# EAGLE design chessclock (EAGLE 9.6.0)
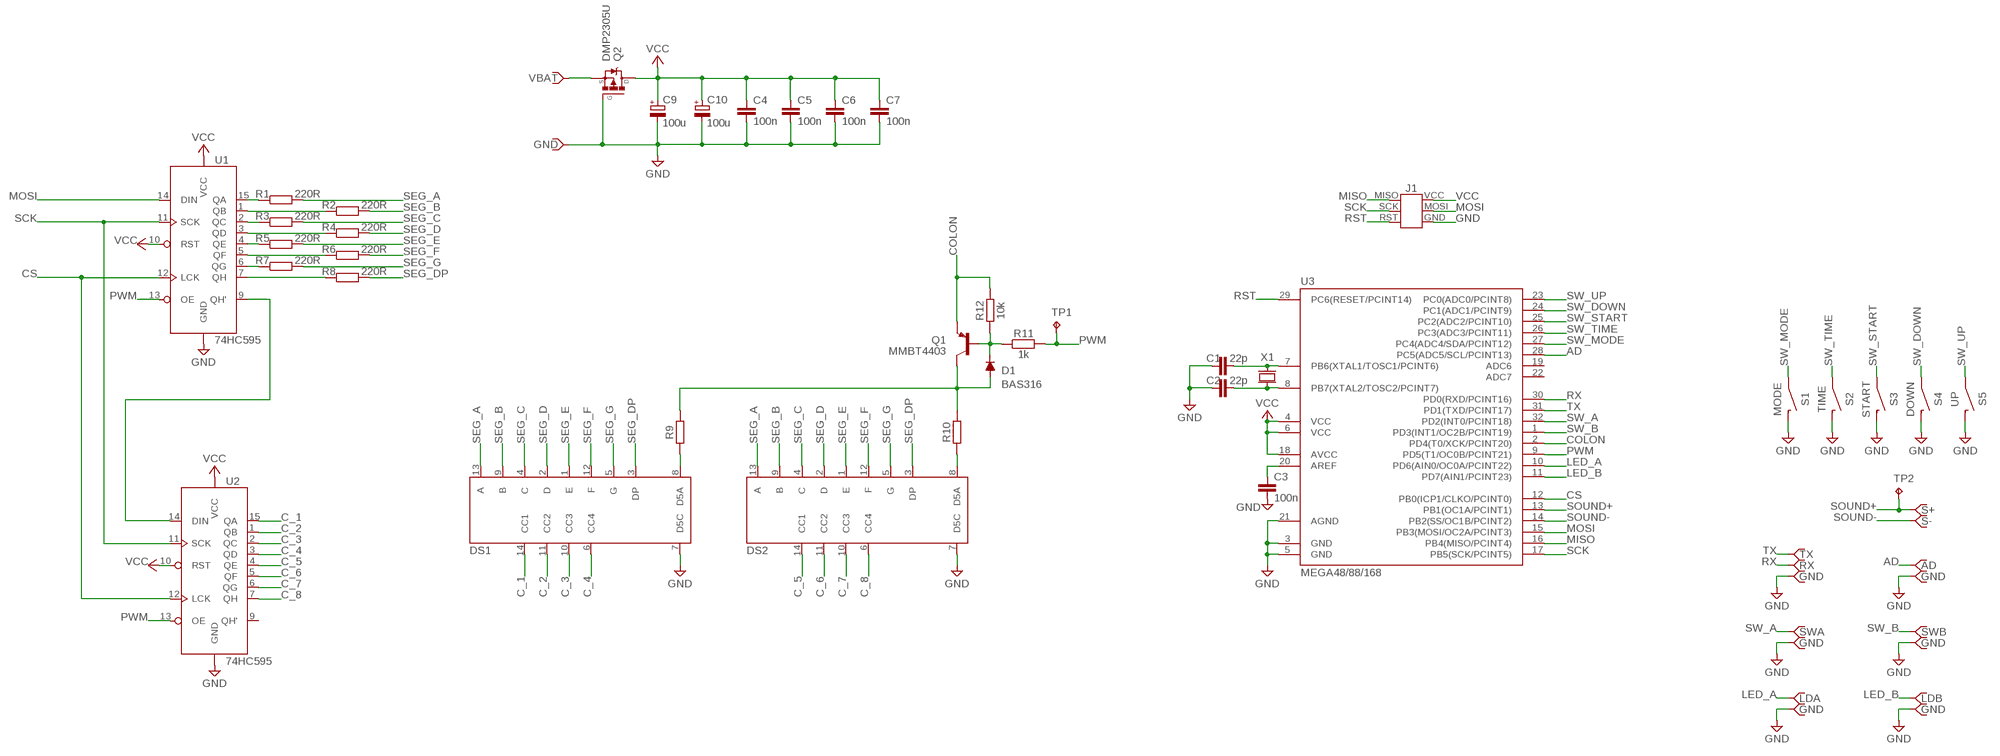
[diagram p0: schematic, sheet 1]

## Parts
C1  22p  CAPACITOR0603  [C_0603]
C2  22p  CAPACITOR0603  [C_0603]
C3  100n  CAPACITOR0603  [C_0603]
C4  100n  CAPACITOR0603  [C_0603]
C5  100n  CAPACITOR0603  [C_0603]
C6  100n  CAPACITOR0603  [C_0603]
C7  100n  CAPACITOR0603  [C_0603]
C9  100u  CAPACITOR_POLARISEDTH_FLAT_L_5MM  [C_E_TH_FLAT_L_5MM]
C10  100u  CAPACITOR_POLARISEDTH_FLAT_L_5MM  [C_E_TH_FLAT_L_5MM]
D1  BAS316  [SOD323]
DS1  SLR0564FR1C4BD-3.5  [SLR0564FR1C4BD-3.5]
DS2  SLR0564FR1C4BD-3.5  [SLR0564FR1C4BD-3.5]
J1  AVRISPVERT  [AVRISP]
P1  SWA  CON_PIN_2MM  [CON_PIN_2MM]
P2  GND  CON_PIN_2MM  [CON_PIN_2MM]
P3  LDA  CON_PIN_2MM  [CON_PIN_2MM]
P4  GND  CON_PIN_2MM  [CON_PIN_2MM]
P5  SWB  CON_PIN_2MM  [CON_PIN_2MM]
P6  GND  CON_PIN_2MM  [CON_PIN_2MM]
P7  LDB  CON_PIN_2MM  [CON_PIN_2MM]
P8  GND  CON_PIN_2MM  [CON_PIN_2MM]
P9  GND  CON_PIN_2MM  [CON_PIN_2MM]
P10  VBAT  CON_PIN_2MM  [CON_PIN_2MM]
P11  S+  CON_PIN_2MM  [CON_PIN_2MM]
P12  S-  CON_PIN_2MM  [CON_PIN_2MM]
P13  GND  CON_PIN  [CON_PIN]
P14  RX  CON_PIN  [CON_PIN]
P15  TX  CON_PIN  [CON_PIN]
P16  GND  CON_PIN  [CON_PIN]
P17  AD  CON_PIN  [CON_PIN]
Q1  MMBT4403  MMBT4403LT1  [SOT23]
Q2  DMP2305U  [SOT23]
R1  220R  RESISTOR0603  [R_0603]
R2  220R  RESISTOR0603  [R_0603]
R3  220R  RESISTOR0603  [R_0603]
R4  220R  RESISTOR0603  [R_0603]
R5  220R  RESISTOR0603  [R_0603]
R6  220R  RESISTOR0603  [R_0603]
R7  220R  RESISTOR0603  [R_0603]
R8  220R  RESISTOR0603  [R_0603]
R9  RESISTOR0603  [R_0603]
R10  RESISTOR0603  [R_0603]
R11  1k  RESISTOR0603  [R_0603]
R12  10k  RESISTOR0603  [R_0603]
S1  MODE  SPST_6X6MM  [SPST_6X6MM]
S2  TIME  SPST_6X6MM  [SPST_6X6MM]
S3  START  SPST_6X6MM  [SPST_6X6MM]
S4  DOWN  SPST_6X6MM  [SPST_6X6MM]
S5  UP  SPST_6X6MM  [SPST_6X6MM]
TP1  TPTP15R  [TP15R]
TP2  TPTP15R  [TP15R]
U1  74HC595  [SOIC16]
U2  74HC595  [SOIC16]
U3  MEGA48/88/168  [TQFP32-08]
X1  XTAL_32768HZ2X6  [XTAL_2X6MM]

## Nets
AD: P17.1 U3.28(PC5(ADC5/SCL/PCINT13))
C_1: DS1.14(CC1) U2.15(QA)
C_2: DS1.11(CC2) U2.1(QB)
C_3: DS1.10(CC3) U2.2(QC)
C_4: DS1.6(CC4) U2.3(QD)
C_5: DS2.14(CC1) U2.4(QE)
C_6: DS2.11(CC2) U2.5(QF)
C_7: DS2.10(CC3) U2.6(QG)
C_8: DS2.6(CC4) U2.7(QH)
COLON: Q1.2(E) R12.2 U3.2(PD4(T0/XCK/PCINT20))
CS: U1.12(LCK) U2.12(LCK) U3.12(PB0(ICP1/CLKO/PCINT0))
GND: C1.2 C2.2 C3.1 C4.1 C5.1 C6.1 C7.1 C9.- C10.- DS1.7(D5C) DS2.7(D5C) J1.GND P2.1 P4.1 P6.1 P8.1 P9.1 P13.1 P16.1 Q2.1(G) S1.3 S1.4 S2.3 S2.4 S3.3 S3.4 S4.3 S4.4 S5.3 S5.4 U1.8(GND) U2.8(GND) U3.3(GND) U3.5(GND) U3.21(AGND)
LED_A: P3.1 U3.10(PD6(AIN0/OC0A/PCINT22))
LED_B: P7.1 U3.11(PD7(AIN1/PCINT23))
MISO: J1.MISO U3.16(PB4(MISO/PCINT4))
MOSI: J1.MOSI U1.14(DIN) U3.15(PB3(MOSI/OC2A/PCINT3))
N$1: C1.1 U3.7(PB6(XTAL1/TOSC1/PCINT6)) X1.1
N$2: C2.1 U3.8(PB7(XTAL2/TOSC2/PCINT7)) X1.2
N$3: R2.1 U1.1(QB)
N$4: R1.1 U1.15(QA)
N$5: R3.1 U1.2(QC)
N$6: D1.A Q1.3(C) R9.2 R10.2
N$7: D1.C Q1.1(B) R11.1 R12.1
N$8: C3.2 U3.20(AREF)
N$12: R5.1 U1.4(QE)
N$13: R4.1 U1.3(QD)
N$14: R6.1 U1.5(QF)
N$15: R7.1 U1.6(QG)
N$17: R8.1 U1.7(QH)
N$19: U1.9(QH') U2.14(DIN)
N$20: DS2.8(D5A) R10.1
N$28: DS1.8(D5A) R9.1
PWM: R11.2 TP1.TP U1.13(OE) U2.13(OE) U3.9(PD5(T1/OC0B/PCINT21))
RST: J1.RST U3.29(PC6(RESET/PCINT14))
RX: P14.1 U3.30(PD0(RXD/PCINT16))
SCK: J1.SCK U1.11(SCK) U2.11(SCK) U3.17(PB5(SCK/PCINT5))
SEG_A: DS1.13(A) DS2.13(A) R1.2
SEG_B: DS1.9(B) DS2.9(B) R2.2
SEG_C: DS1.4(C) DS2.4(C) R3.2
SEG_D: DS1.2(D) DS2.2(D) R4.2
SEG_DP: DS1.3(DP) DS2.3(DP) R8.2
SEG_E: DS1.1(E) DS2.1(E) R5.2
SEG_F: DS1.12(F) DS2.12(F) R6.2
SEG_G: DS1.5(G) DS2.5(G) R7.2
SOUND+: P11.1 TP2.TP U3.13(PB1(OC1A/PCINT1))
SOUND-: P12.1 U3.14(PB2(SS/OC1B/PCINT2))
SW_A: P1.1 U3.32(PD2(INT0/PCINT18))
SW_B: P5.1 U3.1(PD3(INT1/OC2B/PCINT19))
SW_DOWN: S4.1 S4.2 U3.24(PC1(ADC1/PCINT9))
SW_MODE: S1.1 S1.2 U3.27(PC4(ADC4/SDA/PCINT12))
SW_START: S3.1 S3.2 U3.25(PC2(ADC2/PCINT10))
SW_TIME: S2.1 S2.2 U3.26(PC3(ADC3/PCINT11))
SW_UP: S5.1 S5.2 U3.23(PC0(ADC0/PCINT8))
TX: P15.1 U3.31(PD1(TXD/PCINT17))
VBAT: P10.1 Q2.2(S)
VCC: C4.2 C5.2 C6.2 C7.2 C9.+ C10.+ J1.VCC Q2.3(D) U1.10(RST) U1.16(VCC) U2.10(RST) U2.16(VCC) U3.4(VCC) U3.6(VCC) U3.18(AVCC)
Unconnected: U2.9(QH') U3.19(ADC6) U3.22(ADC7)

## Library data of the parts
C1-C7 = a_passive:CAPACITOR
C9 C10 = a_passive:CAPACITOR_POLARISED: Polarised electrolytic capacitors Nichicon WT series
D1 = a_diode:BAS316
DS1 DS2 = a_diode:SLR0564FR1C4BD-3.5
J1 = a_misc:AVRISP: AVR ISP-6 Serial Programming Header
P1-P17 = a_misc:CON_PIN
Q1 = a_transistor:MMBT4403: PNP Transistor
Q2 = a_transistor:DMP2305U
R1-R12 = a_passive:RESISTOR
S1-S5 = a_misc:SPST_6X6MM
TP1 TP2 = a_misc:TP: Test pad
U1 U2 = a_ic:74HC595
U3 = a_ic:MEGA48/88/168
X1 = a_misc:XTAL_32768HZ

## Board
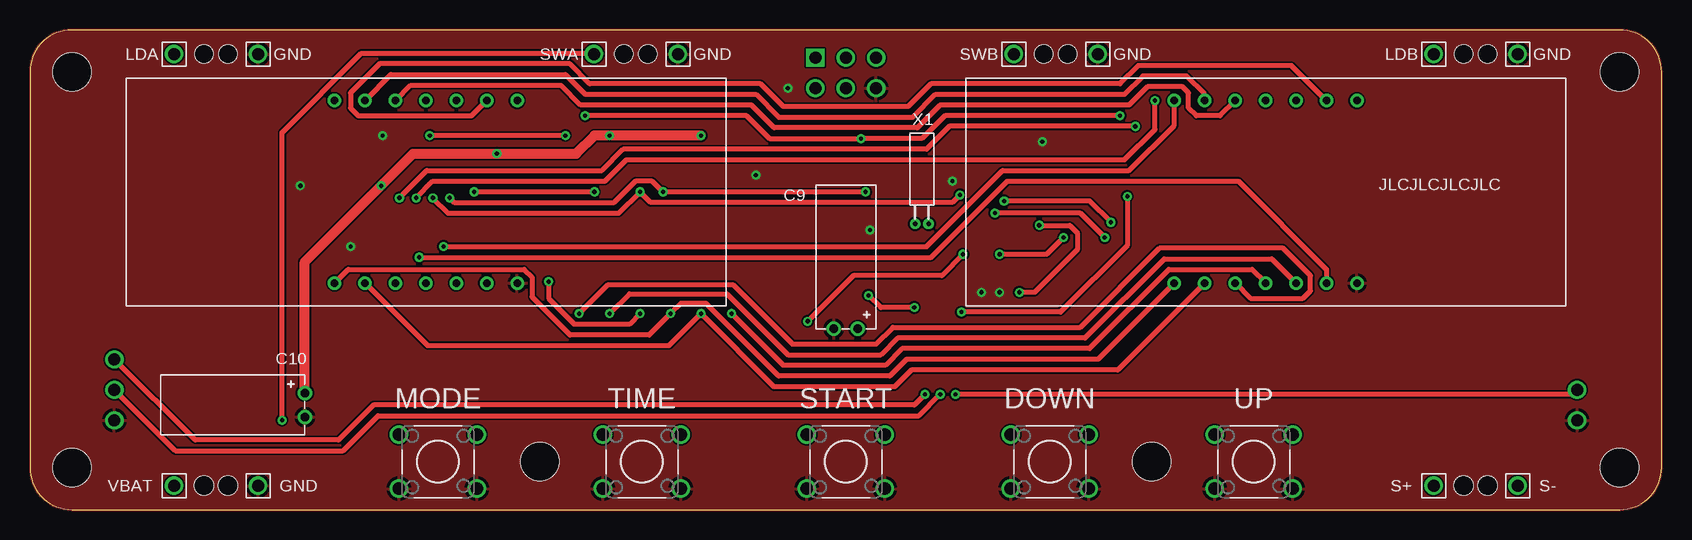
[diagram p1: board, top side]
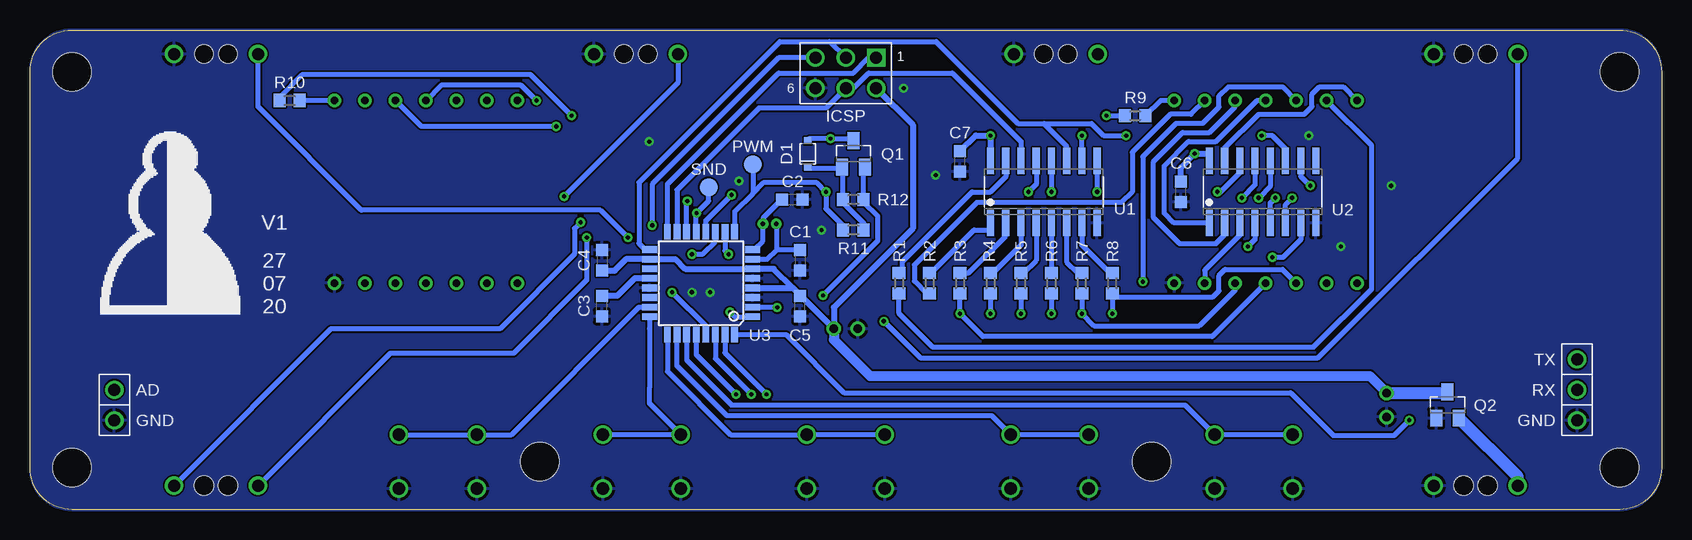
[diagram p2: board, bottom side, seen from below]

Size 136 x 40 mm. Coordinates in mm from the lower left corner, seen from the top.
Outline: 0,36.5 0,3.5 arc90 3.5,0 132.5,0 arc90 136,3.5 136,36.5 arc90 132.5,40 3.5,40 arc90 0,36.5
Copper layers (1*16): Top 0.035mm / dielectric 1.5mm / Bottom 0.035mm
Design rules "default *": minimum track width 6mil, minimum drill 0.35mm, track to track 6mil, track to pad 6mil, pad to pad 6mil, via to via 6mil, smd to smd 6mil, copper to edge 0mil, drill to drill 6mil, minimum pad ring 10mil, minimum via ring 8mil, stop-mask expansion 4mil, vias tented up to drill 0mil, thermal gap 10mil
Holes 3.2 mm at 132.5,36.5 3.5,36.5 3.5,3.5 132.5,3.5 93.5,4 42.5,4
Holes 1.5 mm at 86.5,38 84.5,38 121.5,38 119.5,38 16.5,38 14.5,38 51.5,38 49.5,38
Holes 1.6 mm at 16.5,2 14.5,2 121.5,2 119.5,2

### Footprints (pad centres in the part's own frame; a part is rotated, then mirrored left to right if it is on the bottom)
C_0603 = smd 1 x 1: 1 -0.85,0; 2 0.85,0
C_E_TH_FLAT_L_5MM = drill 0.7: + -1,0; - 1,0
SOD323 = smd 0.6 x 0.6: A 1.1,0; C -1.1,0
SLR0564FR1C4BD-3.5 = drill 0.6: 1 -7.62,-7.62; 2 -5.08,-7.62; 3 -2.54,-7.62; 4 0,-7.62; 5 2.54,-7.62; 6 5.08,-7.62; 7 7.62,-7.62; 8 7.62,7.62; 9 5.08,7.62; 10 2.54,7.62; 11 0,7.62; 12 -2.54,7.62; 13 -5.08,7.62; 14 -7.62,7.62
AVRISP = drill 1: GND 2.54,1.27; MOSI 0,1.27; RST 2.54,-1.27; SCK 0,-1.27; VCC -2.54,1.27 | drill 1 square: MISO -2.54,-1.27
CON_PIN_2MM = drill 1: 1 0,0
CON_PIN = drill 1: 1 0,0
SOT23 = smd 1 x 1.4: 1 -0.95,-1.1; 2 0.95,-1.1; 3 0,1.1
R_0603 = smd 1 x 1.1: 1 -0.85,0; 2 0.85,0
SPST_6X6MM = drill 1.016: 1 -3.25,2.25; 2 3.25,2.25; 3 -3.25,-2.25; 4 3.25,-2.25
TP15R = smd 1.5 x 1.5: TP 0,0
SOIC16 = smd 0.6 x 2.2: 1 -4.445,-2.6; 2 -3.175,-2.6; 3 -1.905,-2.6; 4 -0.635,-2.6; 5 0.635,-2.6; 6 1.905,-2.6; 7 3.175,-2.6; 8 4.445,-2.6; 9 4.445,2.6; 10 3.175,2.6; 11 1.905,2.6; 12 0.635,2.6; 13 -0.635,2.6; 14 -1.905,2.6; 15 -3.175,2.6; 16 -4.445,2.6
TQFP32-08 = smd 1.27 x 0.559: 1 -4.293,2.8; 2 -4.293,2; 3 -4.293,1.2; 4 -4.293,0.4; 5 -4.293,-0.4; 6 -4.293,-1.2; 7 -4.293,-2; 8 -4.293,-2.8; 17 4.293,-2.8; 18 4.293,-2; 19 4.293,-1.2; 20 4.293,-0.4; 21 4.293,0.4; 22 4.293,1.2; 23 4.293,2; 24 4.293,2.8 | smd 0.559 x 1.27: 9 -2.8,-4.293; 10 -2,-4.293; 11 -1.2,-4.293; 12 -0.4,-4.293; 13 0.4,-4.293; 14 1.2,-4.293; 15 2,-4.293; 16 2.8,-4.293; 25 2.8,4.293; 26 2,4.293; 27 1.2,4.293; 28 0.4,4.293; 29 -0.4,4.293; 30 -1.2,4.293; 31 -2,4.293; 32 -2.8,4.293
XTAL_2X6MM = drill 0.4 pad 0.635: 1 -0.559,-4.572; 2 0.559,-4.572

### Placement (x,y rotation side)
C1  71.81,20.79 270 bottom
C2  72.44,25.86 0 bottom
C3  88.32,16.98 90 bottom
C4  88.32,20.79 270 bottom
C5  71.81,16.98 90 bottom
C6  40.06,26.5 90 bottom
C7  58.48,29.04 90 bottom
C9  68,15.07 180 top
C10  22.91,8.72 270 top
D1  71.17,29.68 90 bottom
DS1  33,26.5 0 top
DS2  103,26.5 0 top
J1  68,36.41 180 bottom
P1  47,38 90 top
P2  54,38 90 top
P3  12,38 90 top
P4  19,38 90 top
P5  82,38 90 top
P6  89,38 90 top
P7  117,38 90 top
P8  124,38 90 top
P9  19,2 0 top
P10  12,2 180 top
P11  117,2 180 top
P12  124,2 0 top
P13  7.04,7.45 0 bottom
P14  7.04,9.99 0 bottom
P15  7.04,12.53 0 bottom
P16  128.96,7.45 0 bottom
P17  128.96,9.99 0 bottom
Q1  67.36,29.68 0 bottom
Q2  17.84,8.72 0 bottom
R1  63.55,18.88 270 bottom
R2  61.02,18.88 270 bottom
R3  58.48,18.88 270 bottom
R4  55.94,18.88 270 bottom
R5  53.39,18.88 270 bottom
R6  50.86,18.88 270 bottom
R7  48.31,18.88 270 bottom
R8  45.77,18.88 270 bottom
R9  43.87,32.85 180 bottom
R10  114.35,34.12 180 bottom
R11  67.36,23.32 180 bottom
R12  67.36,25.86 0 bottom
S1  34,4 0 top
S2  51,4 0 top
S3  68,4 0 top
S4  85,4 0 top
S5  102,4 0 top
TP1  75.75,28.79 0 bottom
TP2  79.43,26.88 0 bottom
U1  51.49,26.5 0 bottom
U2  33.25,26.5 0 bottom
U3  80.06,18.88 180 bottom
X1  74.35,28.41 0 top

### Tracks (layer width: path | path; a pad name or v marks a point on that pad's centre or on a via)
AD  (via drill 0.35)
  Top 0.406: P17.1 128.58,9.61 v77.14,9.61
  Bottom 0.406: U3.28 80.47,12.93 v77.14,9.61
C_1
  Bottom 0.406: U2.15 36.42,30.13 33.58,32.98 29.77,32.98 29.14,33.61 29.14,34.63 28.5,35.26 26.52,35.26 DS1.14
C_2
  Bottom 0.406: U2.1 40.64,23.9 41.46,24.72 41.46,28.66 39.42,30.69 37.14,30.69 33.71,34.12 DS1.11
C_3
  Bottom 0.406: DS1.10 35.54,33.61 37.7,31.45 39.93,31.45 42.35,29.04 42.35,24.34 40.19,22.18 37.14,22.18 36.42,22.9 U2.2
C_4
  Bottom 0.406: U2.3 35.16,22.9 38.08,19.97 DS1.6
C_5  (via drill 0.35)
  Top 0.406: v34.47,21.93 74.73,21.93 81.08,28.28 91.62,28.28 95.38,32.04 DS2.14
  Bottom 0.406: U2.4 33.88,22.52 v34.47,21.93
C_6  (via drill 0.35)
  Top 0.406: v32.19,25.99 33.58,27.39 47.93,27.39 49.71,29.17 91.24,29.17 93.78,31.71 v93.78,34.12
  Bottom 0.406: U2.5 32.62,25.56 v32.19,25.99 | v93.78,34.12 95.05,35.39 101.73,35.39 DS2.11
C_7  (via drill 0.35)
  Top 0.406: v30.79,25.99 33.08,28.28 47.68,28.28 49.46,30.06 74.73,30.06 76.64,31.96 v92.13,31.96
  Bottom 0.406: DS2.10 103.38,31.96 v92.13,31.96 | U2.6 31.34,25.44 v30.79,25.99
C_8  (via drill 0.35)
  Top 0.406: v32.44,21.04 75.11,21.04 81.46,27.39 100.71,27.39 108.08,20.02 DS2.6
  Bottom 0.406: U2.7 30.08,22.52 31.55,21.04 v32.44,21.04
COLON  (via drill 0.35)
  Top 0.406: v73.72,16.85 70.92,16.85 v69.91,17.86
  Bottom 0.406: U3.2 73.75,16.88 v73.72,16.85 | v69.91,17.86 65.33,22.44 65.33,24.47 66.52,25.65 R12.2 66.52,28.48 Q1.2
CS  (via drill 0.35)
  Top 0.406: v77.53,26.25 76.89,25.61 51.74,25.61 v50.86,26.5 49.08,24.72 34.85,24.72 v33.58,25.99
  Bottom 0.406: v77.53,26.25 79.66,24.11 U3.12 | U2.12 32.62,26.96 v33.58,25.99 | U1.12 v50.86,26.5
GND  (via drill 0.35)
  other vias: 80.83,18.12 70.03,23.32 76.89,27.39 29.39,31.2 26.73,21.93 22.53,27.01 79.3,18.12 60.51,27.9 63.17,35.14 84.38,30.69
  pour Top: 136,3.5 136,36.5 arc90 132.5,40 3.5,40 arc90 0,36.5 0,3.5 arc90 3.5,0 132.5,0 arc90
  pour Bottom: 3.5,40 132.5,40 arc-90 136,36.5 136,3.5 arc-90 132.5,0 3.5,0 arc-90 0,3.5 0,36.5 arc-90
LED_A  (via drill 0.35)
  Top 0.406: v77.78,21.29 76,19.52 68.64,19.52 v64.83,15.71
  Bottom 0.406: U3.10 78.06,21.58 v77.78,21.29 | v64.83,15.71 61.78,12.66 28.63,12.66 12,29.29 P3.1
LED_B  (via drill 0.35)
  Top 0.406: v80.83,21.29 84.76,21.29 v86.16,22.69
  Bottom 0.406: U3.11 78.86,22.37 79.94,21.29 v80.83,21.29 | P7.1 117,33.59 108.39,24.98 88.45,24.98 v86.16,22.69
MISO
  Bottom 0.406: U3.16 82.86,27.13 81.46,28.53 73.59,36.41 67.36,36.41 66.09,37.68 J1.MISO
MOSI
  Bottom 0.406: U3.15 82.06,26.66 75.24,33.48 69.65,33.48 J1.MOSI 67.36,35.14 66.09,36.41 59.11,36.41 53.39,30.69 U1.14
N$1
  Bottom 0.406: U3.7 74.98,20.88 74.76,20.88 74.55,20.88 73.79,21.63 | X1.1 73.79,21.63 | C1.1 73.79,21.63
N$2
  Bottom 0.406: U3.8 75.64,21.68 74.91,22.42 X1.2 74.86,23.88 74.86,24.34 73.33,25.86 C2.1
N$3
  Bottom 0.406: R2.1 60.89,19.73 57.29,23.32 55.94,23.32 U1.1
N$4
  Bottom 0.406: U1.15 54.66,27.77 55.94,26.5 57.46,26.5 63.3,20.66 63.3,19.98 R1.1
N$5
  Bottom 0.406: U1.2 54.66,22.82 57.75,19.73 R3.1
N$6  (via drill 0.35)
  Top 0.406: v90.86,32.85 76.25,32.85 74.35,30.95 v69.27,30.95 61.65,30.95 59.74,32.85 v46.28,32.85
  Bottom 0.406: Q1.3 67.53,30.95 v69.27,30.95 71,30.95 D1.A | v46.28,32.85 R9.2 | R10.2 115.2,34.37 113.3,36.28 94.29,36.28 v90.86,32.85
N$7
  Bottom 0.406: 68.22,28.48 R12.1 68.22,25.61 66.52,23.91 R11.1 | 68.22,28.48 Q1.1 | D1.C 71.08,28.48 68.22,28.48
N$8
  Bottom 0.508: U3.20 85.59,19.28 87.05,17.82 C3.2
N$12
  Bottom 0.406: U1.4 52.12,20.79 53.18,19.73 R5.1
N$13
  Bottom 0.406: U1.3 53.39,22.05 55.72,19.73 R4.1
N$14
  Bottom 0.406: U1.5 R6.1
N$15
  Bottom 0.406: U1.6 49.59,20.66 48.66,19.73 R7.1
N$17
  Bottom 0.406: U1.7 48.31,22.05 45.99,19.73 R8.1
N$19  (via drill 0.35)
  Top 0.406: v47.05,26.5 v37.01,26.5
  Bottom 0.406: U2.14 35.16,28.1 36.76,26.5 v37.01,26.5 | U1.9 v47.05,26.5
N$20
  Bottom 0.406: DS2.8 R10.1
N$28
  Bottom 0.406: DS1.8 41.75,34.12 R9.1
PWM  (via drill 0.35)
  Top 0.406: v69.65,26.5 v52.76,26.5 51.87,27.39 50.47,27.39 48.7,25.61 35.36,25.61 v34.98,25.99
  Bottom 0.406: 75.75,26.37 77.27,24.86 U3.9 | 75.75,26.37 74.86,27.26 70.41,27.26 v69.65,26.5 69.65,25.1 68.22,23.67 R11.2 | U2.13 33.88,27.09 v34.98,25.99 | U1.13 52.12,27.14 v52.76,26.5 | TP1.TP 75.75,26.37
RST  (via drill 0.35)
  Top 0.406: v84.13,23.71 86.67,23.71 87.3,23.07 87.3,21.67 83.75,18.12 v82.48,18.12
  Bottom 0.406: J1.RST 73.59,37.68 84.13,27.14 v84.13,23.71 | U3.29 79.66,15.3 v82.48,18.12
RX  (via drill 0.35)
  Top 0.406: P14.1 12.12,4.91 26.09,4.91 29.01,7.83 74.1,7.83 v75.87,9.61
  Bottom 0.406: U3.30 78.86,12.6 v75.87,9.61
SCK  (via drill 0.35)
  Top 0.406: v44.63,31.2 v33.33,31.2
  Bottom 0.406: U3.17 84.74,21.68 85.25,22.19 85.25,27.29 73.5,39.03 69.36,39.03 | J1.SCK 69.36,39.03 | U2.11 31.34,30.1 32.44,31.2 v33.33,31.2 | U1.11 49.59,30.31 51.47,32.2 | 69.36,39.03 60.47,39.03 53.63,32.2 51.47,32.2 | 51.47,32.2 47.51,32.2 46.51,31.2 v44.63,31.2
SEG_A
  Top 0.406: DS2.13 97.92,34.63 96.4,36.15 92.77,36.15 91.24,34.63 75.49,34.63 73.59,32.72 62.41,32.72 60.51,34.63 46.28,34.63 44.63,36.28 30.08,36.28 DS1.13
  Bottom 0.406: R1.2 63.55,16.34 60.76,13.55 29.01,13.55 24.19,18.37 24.19,30.38 DS1.13
SEG_B
  Top 0.406: DS2.9 105.16,37.04 92.38,37.04 90.86,35.52 75.11,35.52 73.21,33.61 62.79,33.61 60.89,35.52 46.66,35.52 45.01,37.17 29.14,37.17 26.73,34.76 26.73,33.48 27.36,32.85 36.81,32.85 DS1.9
  Bottom 0.406: R2.2 61.27,18.03 62.28,19.05 62.28,20.4 57.08,25.61 45.01,25.61 44.12,26.5 44.12,29.8 40.95,32.98 39.22,32.98 DS1.9
SEG_C  (via drill 0.35)
  Top 0.406: v58.48,16.34 62.79,12.02 71.3,12.02 72.7,13.42 88.32,13.42 94.92,20.02 101.86,20.02 DS2.4
  Bottom 0.406: DS1.4 37.45,14.44 56.57,14.44 v58.48,16.34 R3.2
SEG_D  (via drill 0.35)
  Top 0.406: DS2.2 90.68,11.64 73.46,11.64 72.06,10.24 62.03,10.24 v55.94,16.34 53.27,13.67 33.13,13.67 DS1.2
  Bottom 0.406: R4.2 v55.94,16.34
SEG_DP  (via drill 0.35)
  Top 0.406: DS2.3 101.73,17.61 106.1,17.61 106.73,18.24 106.73,19.52 104.45,21.8 94.16,21.8 87.56,15.2 71.94,15.2 70.54,13.8 63.55,13.8 58.6,18.75 48.19,18.75 v45.77,16.34
  Bottom 0.406: DS1.3 31.6,20.02 36.38,20.02 36.89,19.52 36.89,18.24 37.39,17.74 45.48,17.74 R8.2 v45.77,16.34
SEG_E  (via drill 0.35)
  Top 0.406: DS1.1 26.52,20.02 41.2,20.02 41.84,19.39 41.84,17.74 45.01,14.56 51.62,14.56 v53.39,16.34 54.26,17.2 56.34,17.2 62.41,11.13 71.68,11.13 73.08,12.53 89.03,12.53 DS2.1
  Bottom 0.406: R5.2 v53.39,16.34
SEG_F  (via drill 0.35)
  Top 0.406: v50.86,16.34 49.97,15.45 45.39,15.45 43.23,17.61 v43.23,19.01 | DS1.12 31.73,35.39 44.25,35.39 45.9,33.74 60.13,33.74 62.03,31.83 73.97,31.83 75.87,33.74 91.62,33.74 93.15,35.26 96.07,35.26 96.58,34.76 96.58,33.48 97.21,32.85 99.19,32.85 DS2.12
  Bottom 0.406: R6.2 v50.86,16.34 | v43.23,19.01 43.23,29.42 40.44,32.22 38.23,32.22 36.89,33.56 36.89,34.5 36.12,35.26 31.6,35.26 DS1.12
SEG_G  (via drill 0.35)
  Top 0.406: v48.31,16.34 49.97,17.99 58.09,17.99 63.17,12.91 70.92,12.91 72.32,14.31 87.94,14.31 94.54,20.91 103.51,20.91 DS2.5
  Bottom 0.406: DS1.5 35.54,18.32 38.54,15.32 47.3,15.32 v48.31,16.34 R7.2
SOUND+  (via drill 0.35)
  Top 0.406: v89.59,22.69 87.56,24.72 v80.45,24.72
  Bottom 0.406: P11.1 105.96,13.04 95.69,13.04 89.59,19.13 v89.59,22.69 | U3.13 80.47,24.7 v80.45,24.72 79.43,25.74 TP2.TP
SOUND-  (via drill 0.35)
  Top 0.406: v90.1,23.96 88.32,25.74 v81.21,25.74
  Bottom 0.406: P12.1 110.93,15.07 96.83,15.07 90.61,21.29 90.61,23.45 v90.1,23.96 | U3.14 81.27,25.68 v81.21,25.74
SW_A  (via drill 0.35)
  Top 0.406: P1.1 46.94,38.06 27.61,38.06 21.01,31.45 v21.01,7.45
  Bottom 0.406: v21.01,7.45 22.28,6.18 27.36,6.18 30.92,9.74 68.13,9.74 72.98,14.59 U3.32
SW_B  (via drill 0.35)
  Top 0.406: v91.47,26.12 91.47,22.03 85.91,16.47 v77.65,16.47
  Bottom 0.406: P5.1 82,35.59 v91.47,26.12 | v77.65,16.47 77.27,16.08 U3.1
SW_DOWN
  Bottom 0.406: S4.2 S4.1 84.36,8.86 84.36,10.14 84.36,15.07 U3.24
SW_MODE
  Bottom 0.406: S1.1 S1.2 39.72,8.72 77.53,8.72 81.27,12.46 U3.27
SW_START
  Bottom 0.406: S3.1 S3.2 77.59,6.25 82.86,11.52 U3.25
SW_TIME
  Bottom 0.406: S2.1 S2.2 55.83,7.83 77.91,7.83 82.06,11.99 U3.26
SW_UP
  Bottom 0.406: S5.2 S5.1 95.87,6.25 85.24,16.88 U3.23
TX  (via drill 0.35)
  Top 0.406: v74.6,9.61 73.72,8.72 28.63,8.72 25.71,5.8 13.77,5.8 P15.1
  Bottom 0.406: U3.31 78.06,13.07 v74.6,9.61
VBAT
  Bottom 1.016: P10.1 12,2.73 Q2.2
VCC  (via drill 0.35)
  Top 0.813: C10.+ 22.91,20.66 v29.27,27.01 31.93,29.68 v38.92,29.68 45.52,29.68 47.05,31.2 v48.31,31.2 v55.94,31.2
  Bottom 0.406: U2.10 30.08,27.79 29.29,27.01 v29.27,27.01 | U1.10 v48.31,31.2
  Bottom 0.508: 71.81,17.88 C9.+ 69,16.86 62.41,23.45 62.41,32.09 J1.VCC | 72.41,18.48 74.01,20.08 U3.6 81.39,20.08 82.19,20.88 U3.18 86.32,20.88 87.27,19.93 C4.2 | U3.4 72.41,18.48 | C5.2 71.81,17.88 | 71.81,17.88 72.41,18.48 | C6.2 40.06,28.53 v38.92,29.68 37.7,29.68 U2.16 | U1.16 v55.94,31.2 57.17,31.2 C7.2
  Bottom 0.813: 17.94,9.72 Q2.3 | C10.+ 24.33,11.13 65.97,11.13 69,14.16 C9.+
  Bottom 1.016: C10.+ 17.94,9.72

### Text on the board
tPlace: JLCJLCJLCJLC
bPlace: 1 | 6 | ICSP | PWM | SND | V1 | 27 | 07 | 20